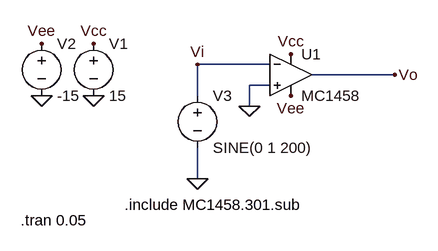
[diagram p0: schematic kadai1-4.asc]
kadai1-4.asc, the LTspice schematic file:
Version 4
SHEET 1 880 680
WIRE 176 144 64 144
WIRE 368 160 240 160
WIRE 176 176 144 176
WIRE 64 192 64 144
WIRE 144 208 144 176
WIRE 64 320 64 272
FLAG -96 192 0
FLAG -176 192 0
FLAG -96 112 Vcc
FLAG -176 112 Vee
FLAG 208 128 Vcc
FLAG 208 192 Vee
FLAG 144 208 0
FLAG 64 320 0
FLAG 368 160 Vo
FLAG 64 144 Vi
SYMBOL OpAmps\\opamp2 208 96 R0
SYMATTR InstName U1
SYMATTR Value MC1458
SYMBOL voltage -96 96 R0
SYMATTR InstName V1
SYMATTR Value 15
SYMBOL voltage -176 96 R0
SYMATTR InstName V2
SYMATTR Value -15
SYMBOL voltage 64 176 R0
WINDOW 123 0 0 Left 0
WINDOW 39 0 0 Left 0
SYMATTR InstName V3
SYMATTR Value SINE(0 1 200)
TEXT -48 360 Left 2 !.include MC1458.301.sub
TEXT -208 384 Left 2 !.tran 0.05

The netlist it stands for:
* kadai1-4.asc
XU1 0 Vi Vcc Vee Vo MC1458  ; pins In+ In- V+ V- OUT
V1 Vcc 0 15
V2 Vee 0 -15
V3 Vi 0 SINE(0 1 200)
.include MC1458.301.sub
.tran 0.05
.backanno
.end